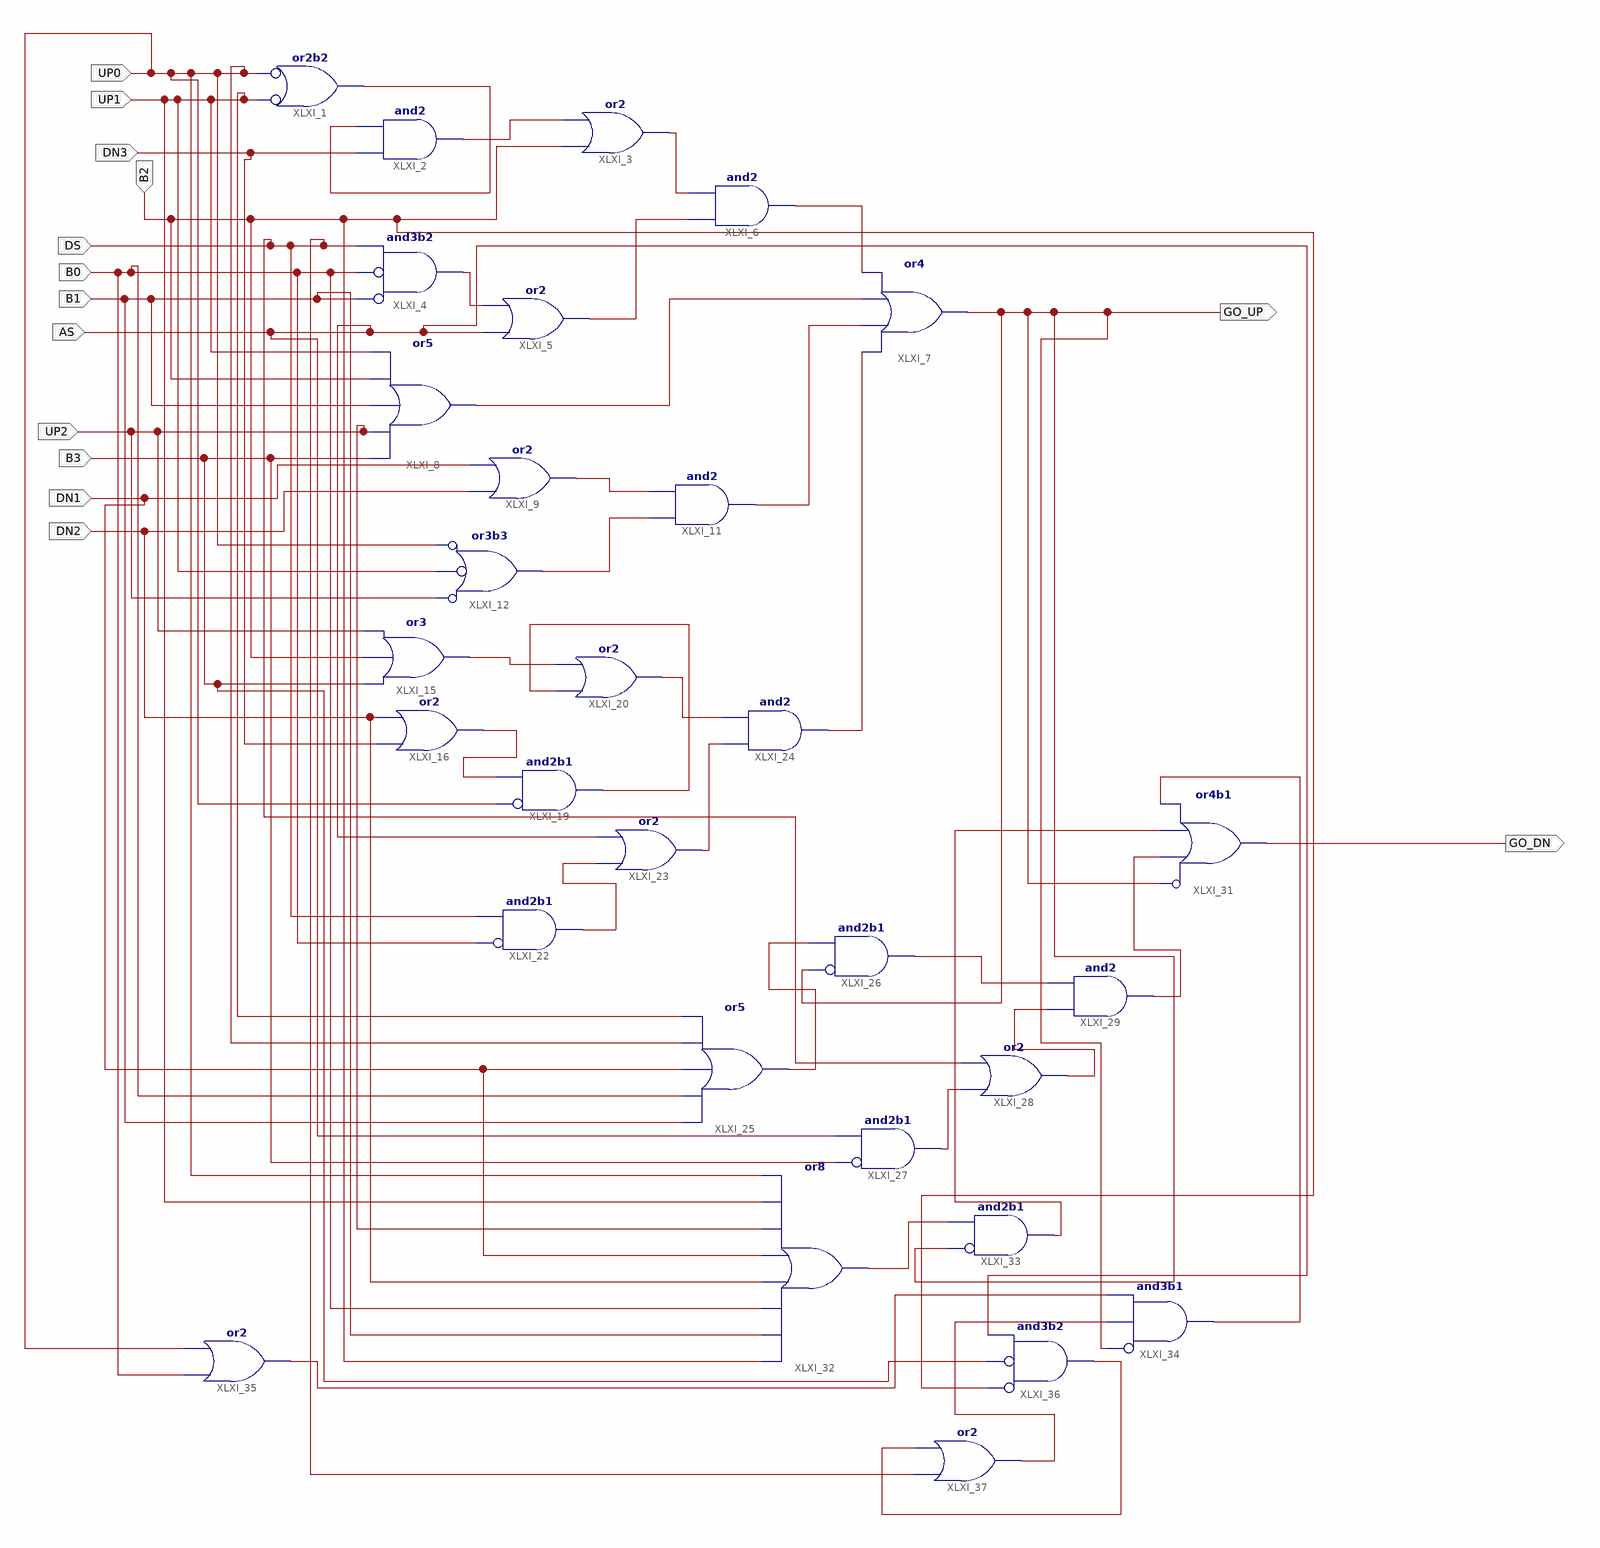
[diagram p0: schematic sheet 1]
// Xilinx ISE schematic 2018CS10354_2018CS10348.sch (spartan6) as structural Verilog: 30 symbols, 14 ports
module \2018CS10354_2018CS10348  (
  input  UP0,
  input  UP1,
  input  DN3,
  input  B2,
  input  DS,
  input  B1,
  input  AS,
  input  UP2,
  input  B3,
  input  DN1,
  input  DN2,
  input  B0,
  output GO_UP,
  output GO_DN
);

  wire XLXN_3, XLXN_5, XLXN_10, XLXN_12, XLXN_13, XLXN_14, XLXN_20, XLXN_21, XLXN_22, XLXN_23, XLXN_33,
       XLXN_34, XLXN_35, XLXN_39, XLXN_40, XLXN_41, XLXN_42, XLXN_46, XLXN_48, XLXN_49, XLXN_50, XLXN_54,
       XLXN_60, XLXN_62, XLXN_63, XLXN_65, XLXN_67, XLXN_68;

  or XLXI_1 (XLXN_3, ~UP1, ~UP0);  // or2b2
  and XLXI_2 (XLXN_5, DN3, XLXN_3);
  or XLXI_3 (XLXN_12, B2, XLXN_5);
  and XLXI_4 (XLXN_10, ~B1, ~B0, DS);  // and3b2
  or XLXI_5 (XLXN_13, AS, XLXN_10);
  and XLXI_6 (XLXN_14, XLXN_13, XLXN_12);
  or XLXI_7 (GO_UP, XLXN_42, XLXN_23, XLXN_20, XLXN_14);
  or XLXI_8 (XLXN_20, B3, UP2, B1, B2, UP1);
  or XLXI_9 (XLXN_21, DN2, DN1);
  and XLXI_11 (XLXN_23, XLXN_22, XLXN_21);
  or XLXI_12 (XLXN_22, ~UP2, ~UP1, ~UP0);  // or3b3
  or XLXI_15 (XLXN_34, B3, B2, UP2);
  or XLXI_16 (XLXN_33, DN3, DN2);
  and XLXI_19 (XLXN_35, ~UP0, XLXN_33);  // and2b1
  or XLXI_20 (XLXN_40, XLXN_35, XLXN_34);
  and XLXI_22 (XLXN_39, ~B0, DS);  // and2b1
  or XLXI_23 (XLXN_41, XLXN_39, AS);
  and XLXI_24 (XLXN_42, XLXN_41, XLXN_40);
  or XLXI_25 (XLXN_46, B1, B0, DN1, UP0, UP1);
  and XLXI_26 (XLXN_50, ~GO_UP, XLXN_46);  // and2b1
  and XLXI_27 (XLXN_48, ~B3, AS);  // and2b1
  or XLXI_28 (XLXN_49, XLXN_48, DS);
  and XLXI_29 (XLXN_54, XLXN_49, XLXN_50);
  or XLXI_31 (GO_DN, ~GO_UP, XLXN_54, XLXN_62, XLXN_63);  // or4b1
  or XLXI_32 (XLXN_60, B2, B1, B0, DN2, DN1, UP2, UP1, UP0);
  and XLXI_33 (XLXN_62, ~GO_UP, XLXN_60);  // and2b1
  and XLXI_34 (XLXN_63, ~GO_UP, XLXN_68, XLXN_65);  // and3b1
  or XLXI_35 (XLXN_65, B0, UP0);
  and XLXI_36 (XLXN_67, ~B2, ~B3, AS);  // and3b2
  or XLXI_37 (XLXN_68, DS, XLXN_67);
endmodule
